# Altium schematic sheet 6_DIDO.schdoc
size 307 x 218 mm; Symbol: A4空白; Device: A4空白; @Project Name: 34567890; @Page Count: 7; @Update Date: 2025-05-12; @Create Date: 2025-03-11; @Schematic Name: Schematic1; @Page No: 6; @Page Name: DIDO; @Create Time: 07:05:34; @Board Name: PCB; @Update Time: 12:27:34; Title Block Position: 3; Width: 1170; Height: 825; Region Start: 1; X Region Count: 6; Y Region Count: 4; Blade Width: 10; SheetNumber: 6; SheetTotal: 7
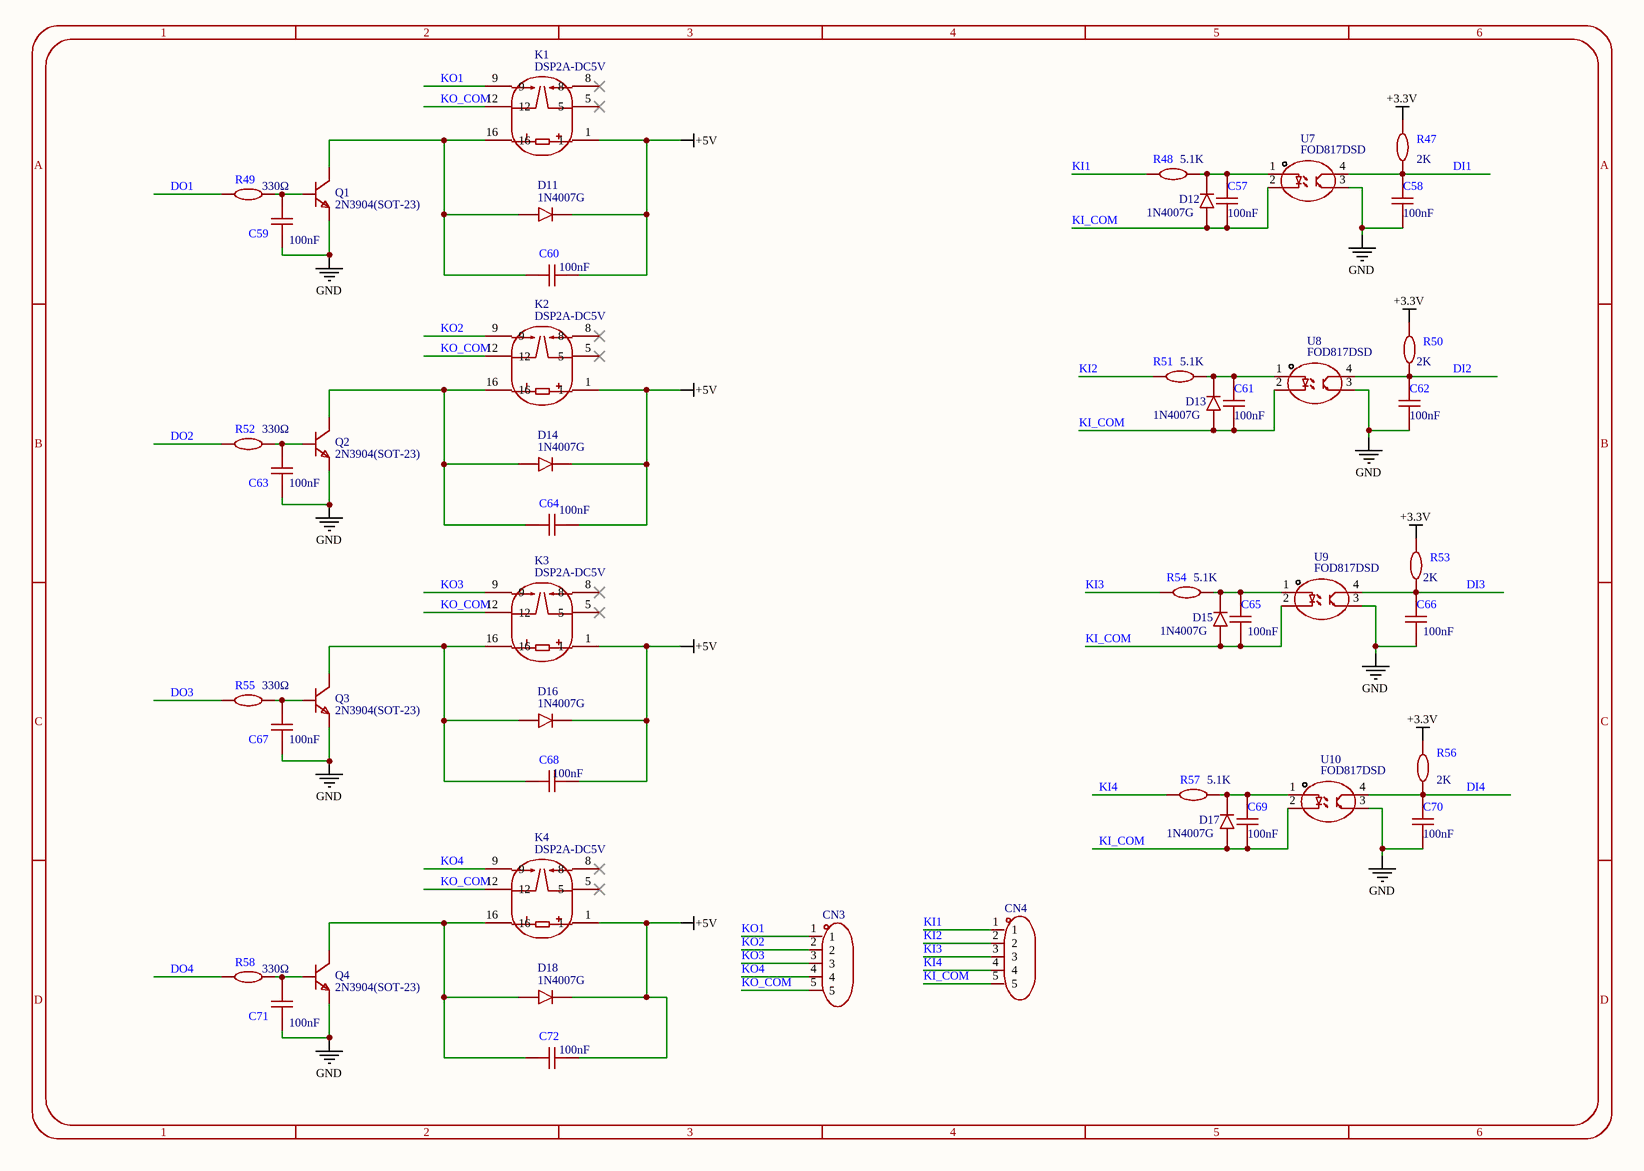
[diagram p0: 6_DIDO.schdoc]

## Parts
C57  100nF  [C0603]
C58  100nF  [C0603]
C59  100nF  [C0603]
C60  100nF  [C0603]
C61  100nF  [C0603]
C62  100nF  [C0603]
C63  100nF  [C0603]
C64  100nF  [C0603]
C65  100nF  [C0603]
C66  100nF  [C0603]
C67  100nF  [C0603]
C68  100nF  [C0603]
C69  100nF  [C0603]
C70  100nF  [C0603]
C71  100nF  [C0603]
C72  100nF  [C0603]
CN3  WJ15EDGRC-3.81-5P  [CONN-TH_5P-P3.81_WJ15EDGRC-3.81-5P]  (value not drawn)
CN4  WJ15EDGRC-3.81-5P  [CONN-TH_5P-P3.81_WJ15EDGRC-3.81-5P]  (value not drawn)
D11  1N4007G  [SMA_L4.4-W2.6-LS5.0-RD]
D12  1N4007G  [SMA_L4.4-W2.6-LS5.0-RD]
D13  1N4007G  [SMA_L4.4-W2.6-LS5.0-RD]
D14  1N4007G  [SMA_L4.4-W2.6-LS5.0-RD]
D15  1N4007G  [SMA_L4.4-W2.6-LS5.0-RD]
D16  1N4007G  [SMA_L4.4-W2.6-LS5.0-RD]
D17  1N4007G  [SMA_L4.4-W2.6-LS5.0-RD]
D18  1N4007G  [SMA_L4.4-W2.6-LS5.0-RD]
K1  DSP2A-DC5V  [RELAY-TH_DSP2A-DC5V]
K2  DSP2A-DC5V  [RELAY-TH_DSP2A-DC5V]
K3  DSP2A-DC5V  [RELAY-TH_DSP2A-DC5V]
K4  DSP2A-DC5V  [RELAY-TH_DSP2A-DC5V]
Q1  2N3904(SOT-23)  [SOT-23-3_L2.9-W1.3-P1.90-LS2.4-TR]
Q2  2N3904(SOT-23)  [SOT-23-3_L2.9-W1.3-P1.90-LS2.4-TR]
Q3  2N3904(SOT-23)  [SOT-23-3_L2.9-W1.3-P1.90-LS2.4-TR]
Q4  2N3904(SOT-23)  [SOT-23-3_L2.9-W1.3-P1.90-LS2.4-TR]
R47  2K  [R0603]
R48  5.1K  [R0603]
R49  330Ω  [R0603]
R50  2K  [R0603]
R51  5.1K  [R0603]
R52  330Ω  [R0603]
R53  2K  [R0603]
R54  5.1K  [R0603]
R55  330Ω  [R0603]
R56  2K  [R0603]
R57  5.1K  [R0603]
R58  330Ω  [R0603]
U7  FOD817DSD  [SMD-4_L4.6-W6.4-P2.54-LS10.0-BL]
U8  FOD817DSD  [SMD-4_L4.6-W6.4-P2.54-LS10.0-BL]
U9  FOD817DSD  [SMD-4_L4.6-W6.4-P2.54-LS10.0-BL]
U10  FOD817DSD  [SMD-4_L4.6-W6.4-P2.54-LS10.0-BL]

## Nets
+3.3V: R47.1 R50.1 R53.1 R56.1
+5V: C60.2 C64.2 C68.2 C72.2 D11.1(C) D14.1(C) D16.1(C) D18.1(C) K1.1 K2.1 K3.1 K4.1
GND: C58.1 C59.2 C62.1 C63.2 C66.1 C67.2 C70.1 C71.2 Q1.1(E) Q2.1(E) Q3.1(E) Q4.1(E) U7.3(E) U8.3(E) U9.3(E) U10.3(E)
DI1: C58.2 R47.2 U7.4(C)
DI2: C62.2 R50.2 U8.4(C)
DI3: C66.2 R53.2 U9.4(C)
DI4: C70.2 R56.2 U10.4(C)
DO1: R49.2
DO2: R52.2
DO3: R55.2
DO4: R58.2
KI1: CN4.1 R48.2
KI2: CN4.2 R51.2
KI3: CN4.3 R54.2
KI4: CN4.4 R57.2
KI_COM: C57.1 C61.1 C65.1 C69.1 CN4.5 D12.2(A) D13.2(A) D15.2(A) D17.2(A) U7.2(C) U8.2(C) U9.2(C) U10.2(C)
KO1: CN3.1 K1.9
KO2: CN3.2 K2.9
KO3: CN3.3 K3.9
KO4: CN3.4 K4.9
KO_COM: CN3.5 K1.12 K2.12 K3.12 K4.12
NetC57_2: C57.2 D12.1(C) R48.1 U7.1(A)
NetC59_1: C59.1 Q1.2(B) R49.1
NetC60_1: C60.1 D11.2(A) K1.16 Q1.3(C)
NetC61_2: C61.2 D13.1(C) R51.1 U8.1(A)
NetC63_1: C63.1 Q2.2(B) R52.1
NetC64_1: C64.1 D14.2(A) K2.16 Q2.3(C)
NetC65_2: C65.2 D15.1(C) R54.1 U9.1(A)
NetC67_1: C67.1 Q3.2(B) R55.1
NetC68_1: C68.1 D16.2(A) K3.16 Q3.3(C)
NetC69_2: C69.2 D17.1(C) R57.1 U10.1(A)
NetC71_1: C71.1 Q4.2(B) R58.1
NetC72_1: C72.1 D18.2(A) K4.16 Q4.3(C)

Not connected (* = marked no-connect by the designer): K1 5* 8*; K2 5* 8*; K3 5* 8*; K4 5* 8*

## Notes on the sheet
- 1
- 2
- 3
- 4
- 5
- 6
- A
- B
- C
- D

## Library data of the parts
C57-C72 = CAP_0603: Device: CAP_0603
Q1-Q4 = 2n3904S-RTK/PS: Device: 2n3904S-RTK/PS
R47-R58 = Res_0603: Device: Res_0603
CN3 CN4 = WJ15EDGRC-3.81-5P: Device: WJ15EDGRC-3.81-5P
D11-D18 = 1N4007G: Device: 1N4007G
K1-K4 = DSP2A-DC5V: Device: DSP2A-DC5V
U7-U10 = FOD817DSD: Device: FOD817DSD